# Altium project Class_first.PrjPcb
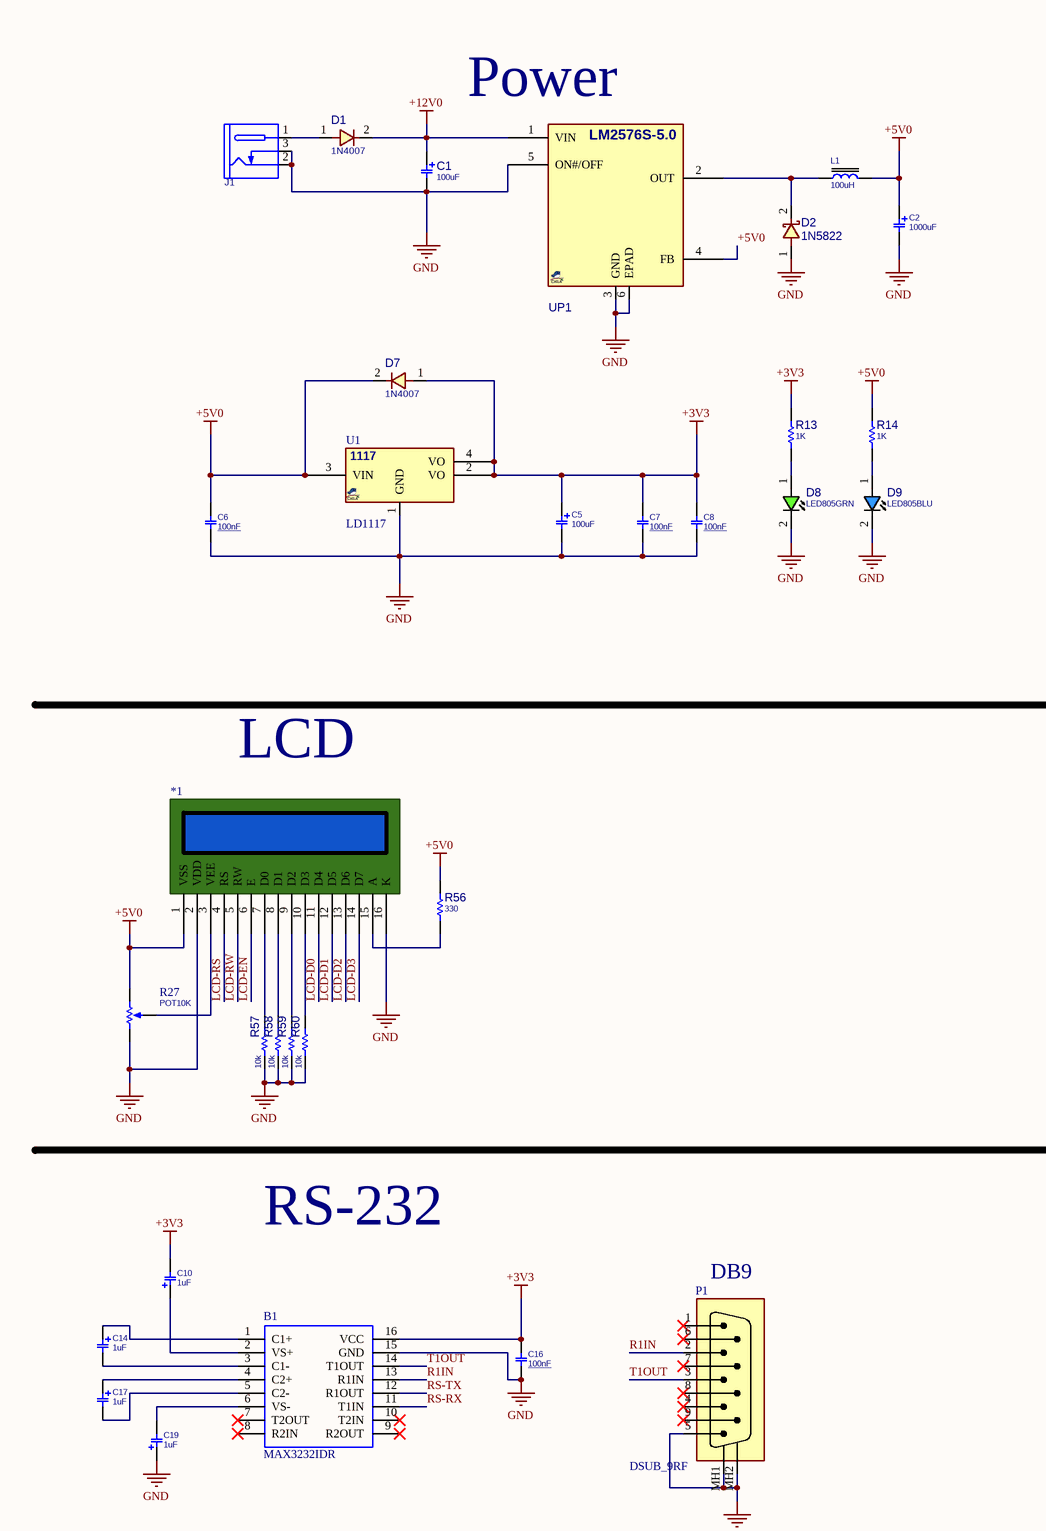
[diagram p0: Sheet1.SchDoc, top left]
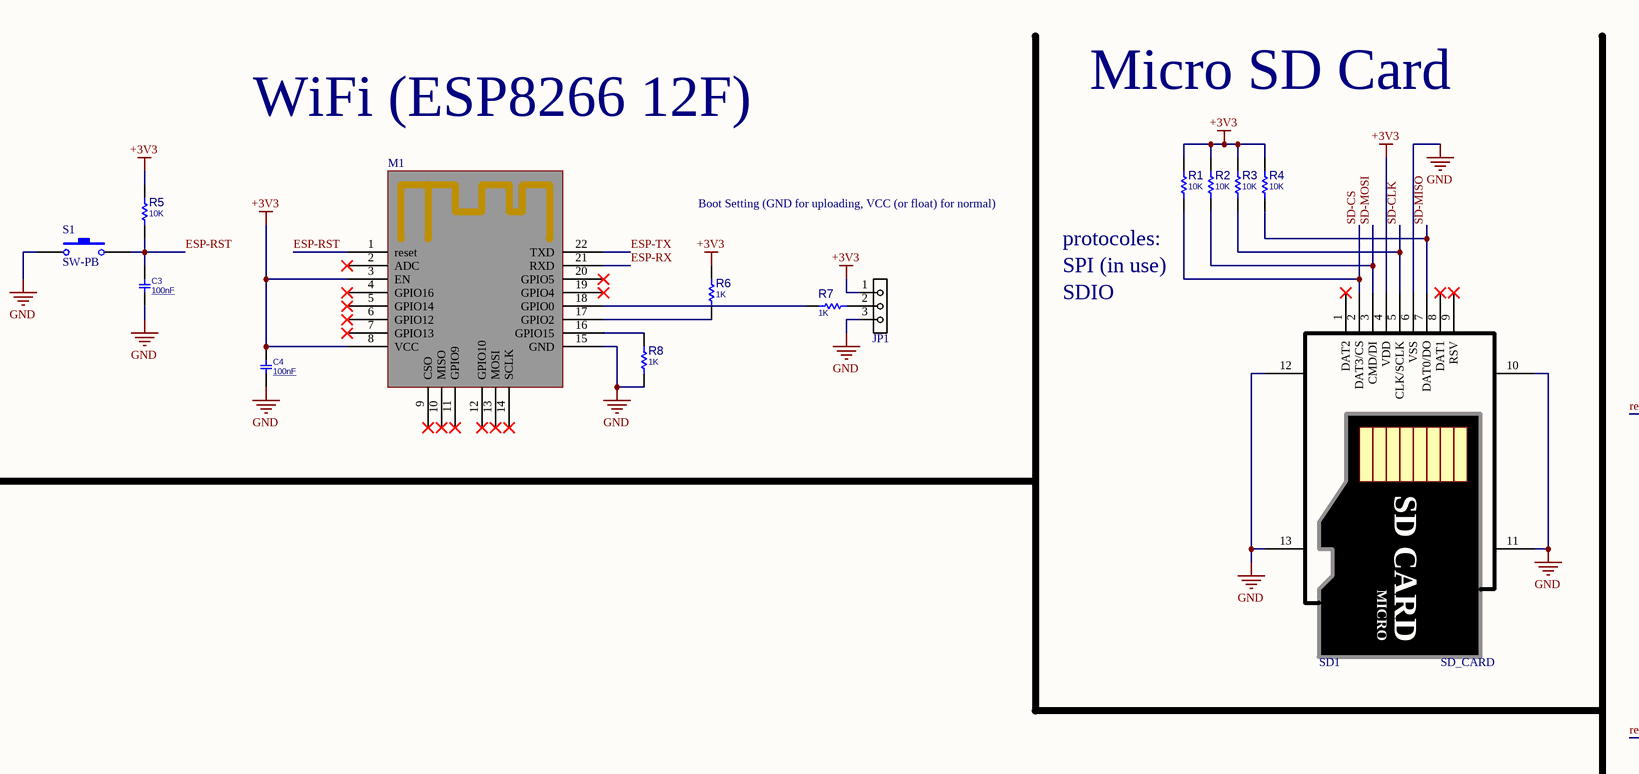
[diagram p1: Sheet1.SchDoc, top middle]
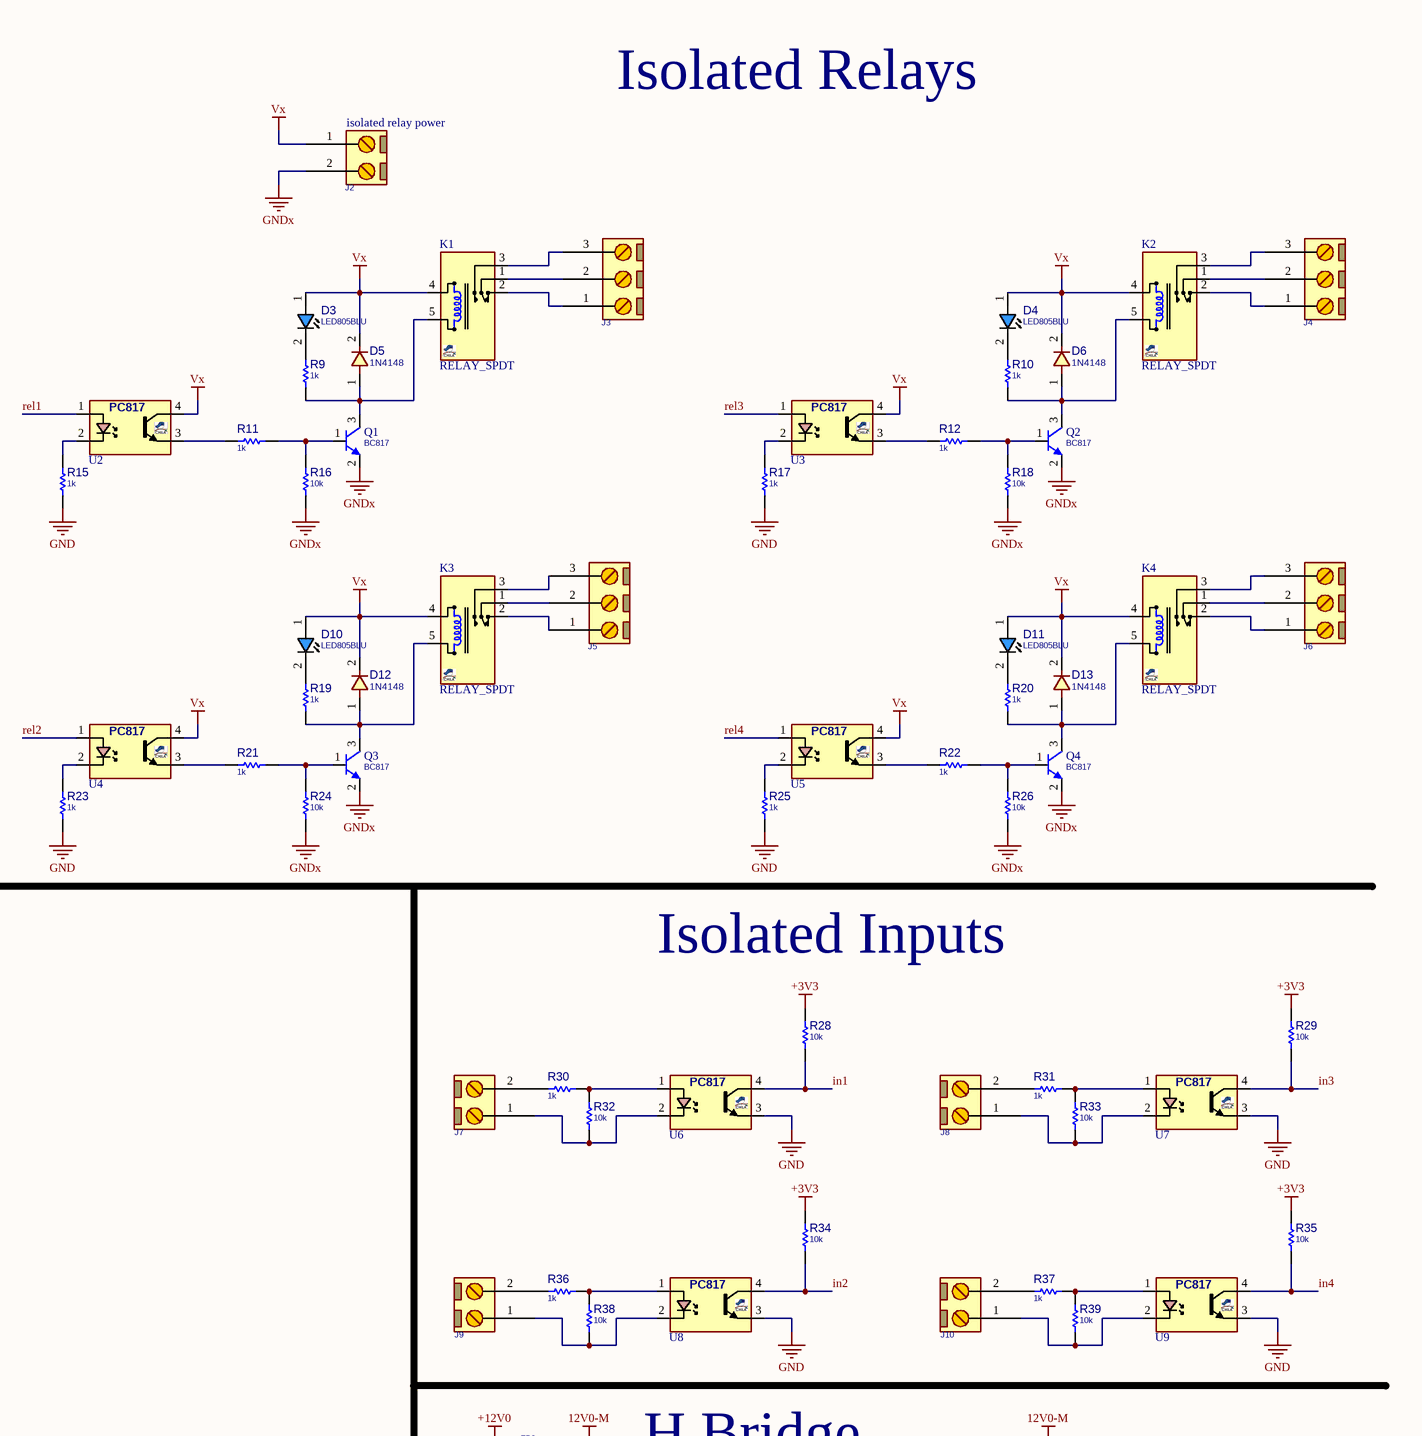
[diagram p2: Sheet1.SchDoc, top right]
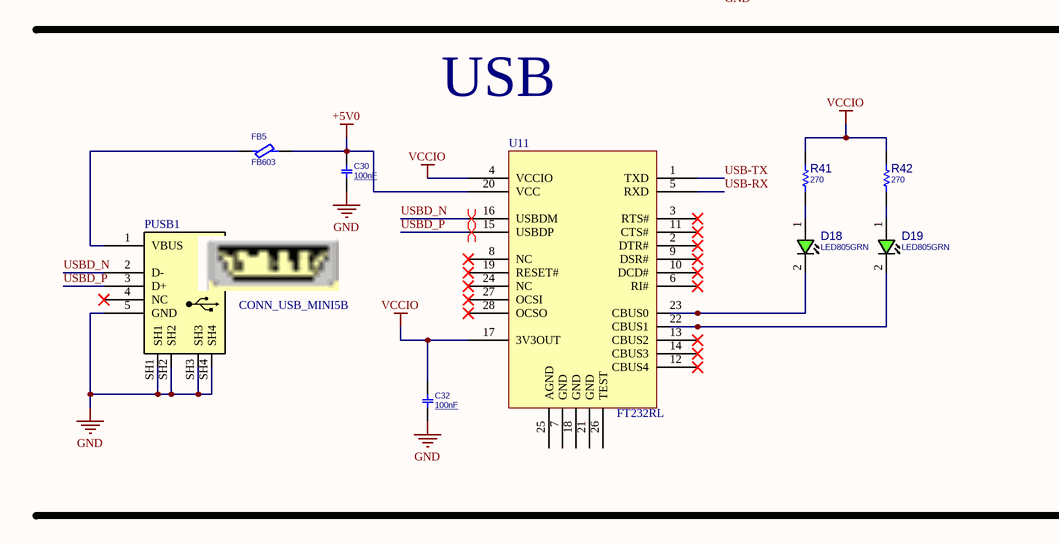
[diagram p3: Sheet1.SchDoc, bottom left]
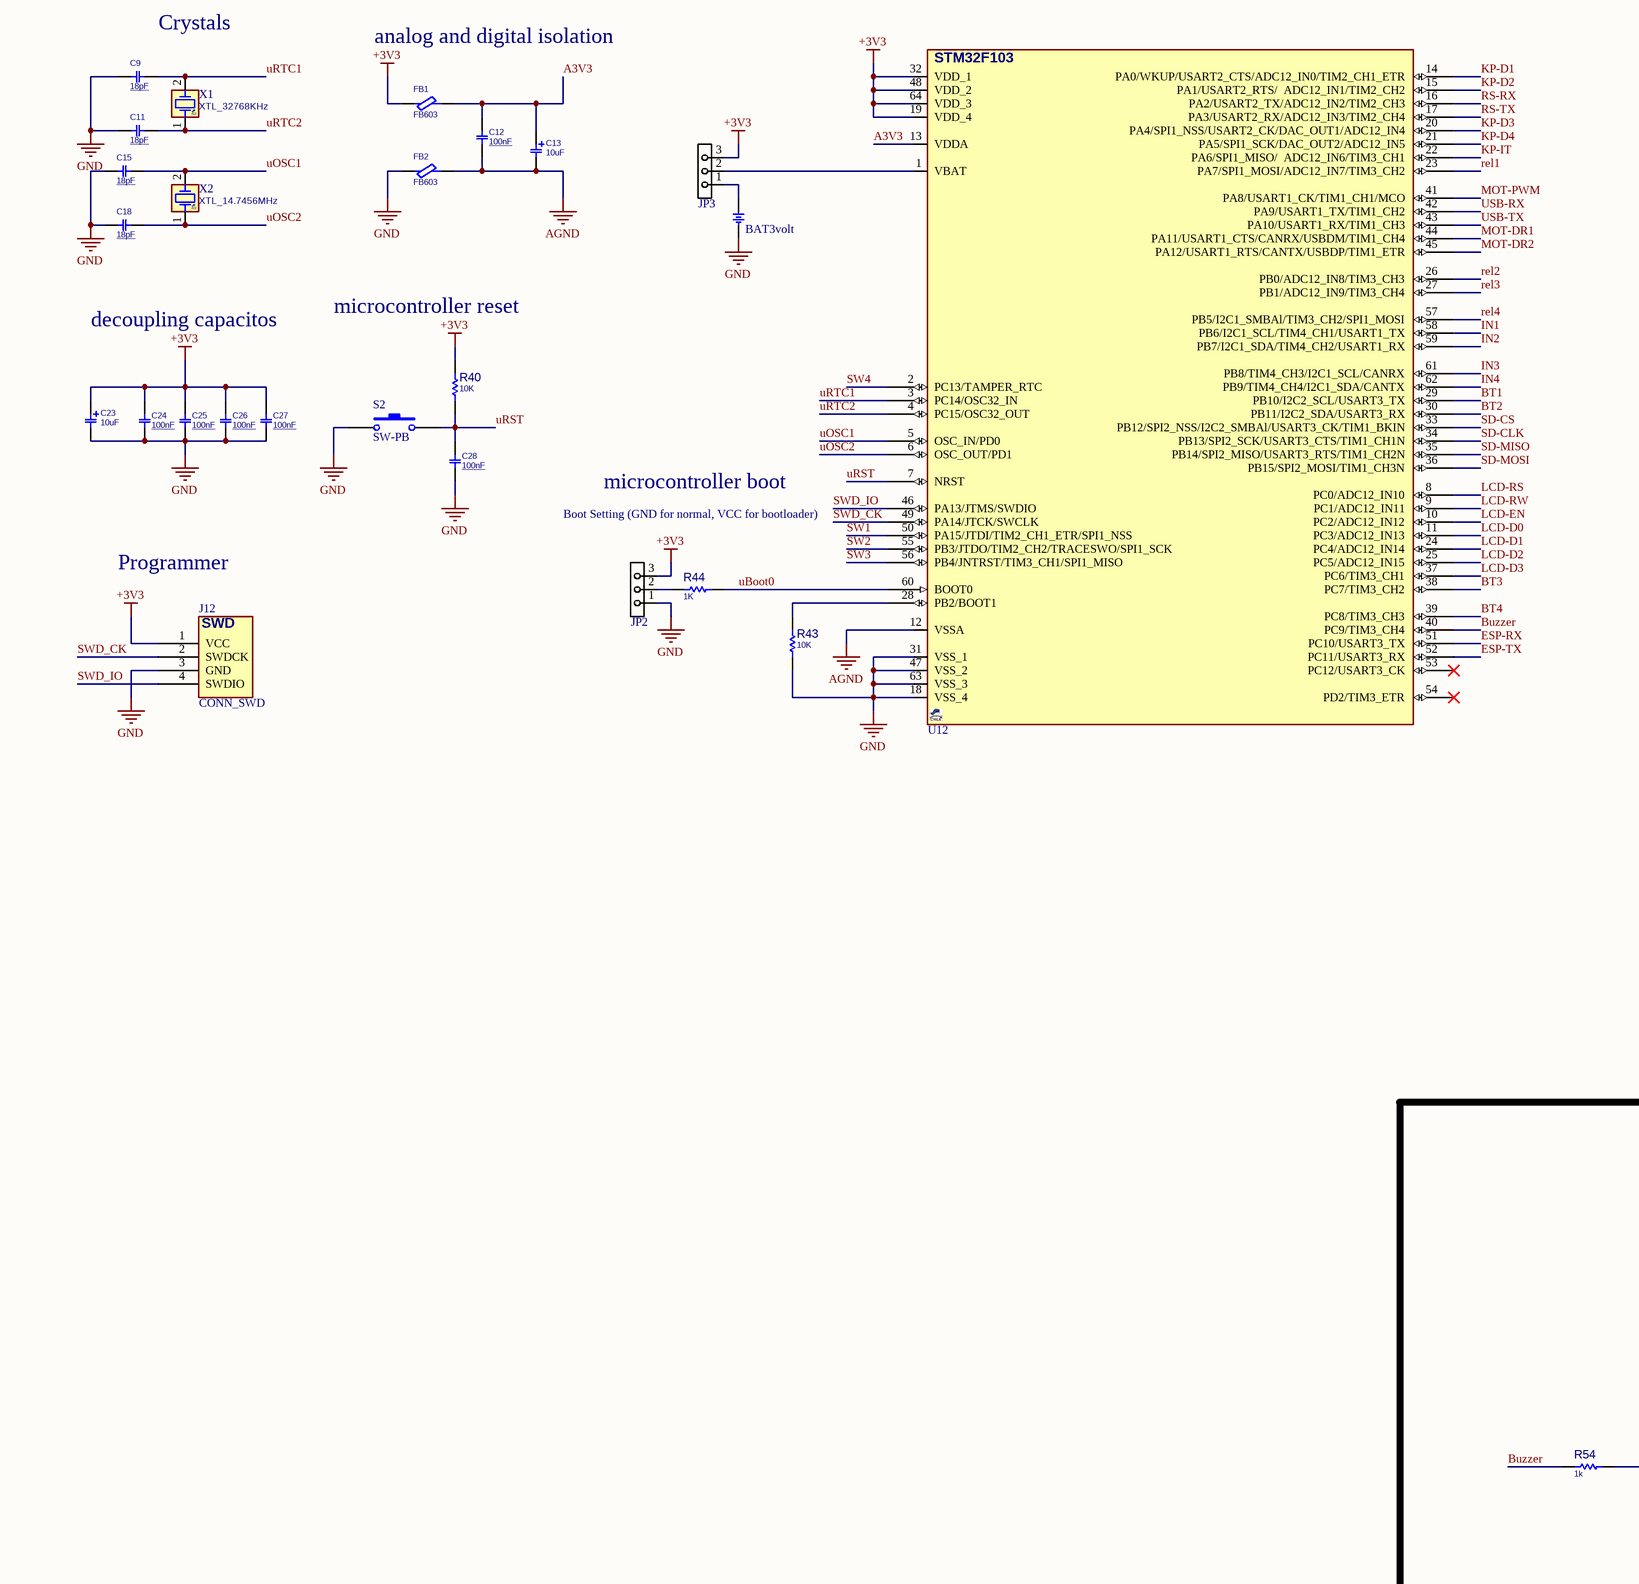
[diagram p4: Sheet1.SchDoc, bottom middle]
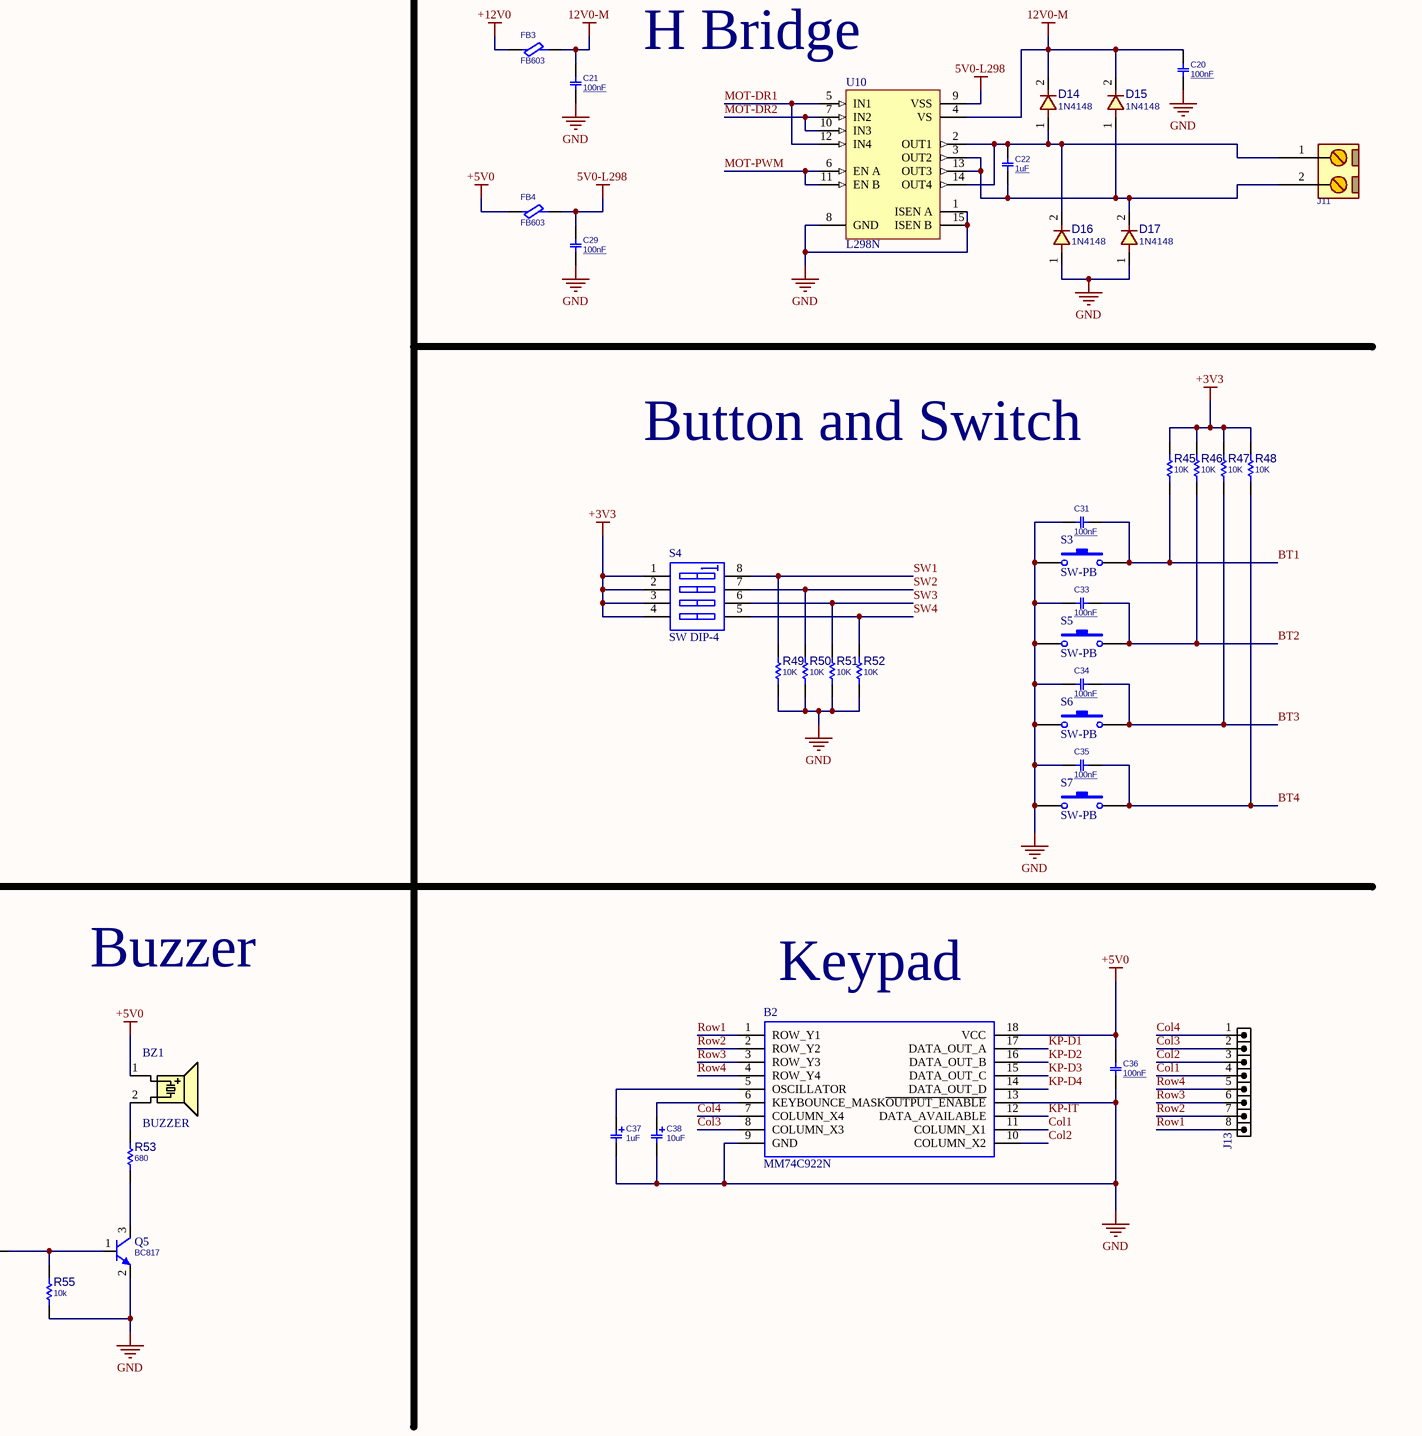
[diagram p5: Sheet1.SchDoc, bottom right]
1 sheet, 179 parts. Net scope: global (net labels, ports and power ports of the same name join across sheets).
Board file: PCB1.PcbDoc

## Sheet Sheet1.SchDoc
size A1; SheetNumber: 1; SheetTotal: 1

### Parts
*1  LCD2x16  [LCDCHAR_16X2_BLU]  (value not drawn)
B1  MAX3232IDR  [SO_16]
B2  MM74C922N  [DIP_18]
BT1  BAT3volt  [BTH1220]
BZ1  BUZZER  [BZ_C9]
C1  100uF  [C_EL_5]
C2  1000uF  [C_TN_3528]
C3  100nF  [C0805]
C4  100nF  [C0805]
C5  100uF  [C_TN_3528]
C6  100nF  [C0805]
C7  100nF  [C0805]
C8  100nF  [C0805]
C9  18pF  [C0805]
C10  1uF  [C_TN_3528]
C11  18pF  [C0805]
C12  100nF  [C0805]
C13  10uF  [C_TN_3528]
C14  1uF  [C_TN_3528]
C15  18pF  [C0805]
C16  100nF  [C0805]
C17  1uF  [C_TN_3528]
C18  18pF  [C0805]
C19  1uF  [C_TN_3528]
C20  100nF  [C0805]
C21  100nF  [C0805]
C22  1uF  [C0805]
C23  10uF  [C_TN_3528]
C24  100nF  [C0805]
C25  100nF  [C0805]
C26  100nF  [C0805]
C27  100nF  [C0805]
C28  100nF  [C0805]
C29  100nF  [C0805]
C30  100nF  [C0805]
C31  100nF  [C0805]
C32  100nF  [C0805]
C33  100nF  [C0805]
C34  100nF  [C0805]
C35  100nF  [C0805]
C36  100nF  [C0805]
C37  1uF  [C_TN_3528]
C38  10uF  [C_TN_3528]
D1  1N4007  [D_SMA]
D2  1N5822  [D_SMA]
D3  LED805BLU  [LED0805BLU]
D4  LED805BLU  [LED0805BLU]
D5  1N4148  [D_SOD80]
D6  1N4148  [D_SOD80]
D7  1N4007  [D_SMA]
D8  LED805GRN  [LED0805GRN]
D9  LED805BLU  [LED0805BLU]
D10  LED805BLU  [LED0805BLU]
D11  LED805BLU  [LED0805BLU]
D12  1N4148  [D_SOD80]
D13  1N4148  [D_SOD80]
D14  1N4148  [D_SOD80]
D15  1N4148  [D_SOD80]
D16  1N4148  [D_SOD80]
D17  1N4148  [D_SOD80]
D18  LED805GRN  [LED0805GRN]
D19  LED805GRN  [LED0805GRN]
FB1  FB603  [L0805]
FB2  FB603  [L0805]
FB3  FB603  [L0805]
FB4  FB603  [L0805]
FB5  FB603  [L0805]
J1  DC_POWER_JACK  [JAC_PWR2]  (value not drawn)
J2  CONN_TB2  [MSTB_2]  (value not drawn)
J3  CONN_TB3  [MSTB_3]  (value not drawn)
J4  CONN_TB3  [MSTB_3]  (value not drawn)
J5  CONN_TB3  [MSTB_3]  (value not drawn)
J6  CONN_TB3  [MSTB_3]  (value not drawn)
J7  CONN_TB2  [MSTB_2]  (value not drawn)
J8  CONN_TB2  [MSTB_2]  (value not drawn)
J9  CONN_TB2  [MSTB_2]  (value not drawn)
J10  CONN_TB2  [MSTB_2]  (value not drawn)
J11  CONN_TB2  [TBB_2]  (value not drawn)
J12  CONN_SWD  [WF_4]
J13  HDR1X8  [HDR_M_1X8]  (value not drawn)
JP1  JMPHDR3PIN  [JP_3]  (value not drawn)
JP2  JMPHDR3PIN  [JP_3]  (value not drawn)
JP3  JMPHDR3PIN  [JP_3]  (value not drawn)
K1  RELAY_SPDT  [REL_SPDT_5_2216]
K2  RELAY_SPDT  [REL_SPDT_5_2216]
K3  RELAY_SPDT  [REL_SPDT_5_2216]
K4  RELAY_SPDT  [REL_SPDT_5_2216]
L1  100uH  [LTOR_25X10]
M1  ESP12F  [ESP8266_ESP12E]  (value not drawn)
P1  DSUB_9RF  [DSUB_9RF]
PUSB1  CONN_USB_MINI5B  [USB_MINI_B5_CABLE]
Q1  BC817  [SOT23_3]
Q2  BC817  [SOT23_3]
Q3  BC817  [SOT23_3]
Q4  BC817  [SOT23_3]
Q5  BC817  [SOT23_3]
R1  10K  [R0805]
R2  10K  [R0805]
R3  10K  [R0805]
R4  10K  [R0805]
R5  10K  [R0805]
R6  1K  [R0805]
R7  1K  [R0805]
R8  1K  [R0805]
R9  1k  [R0805]
R10  1k  [R0805]
R11  1k  [R0805]
R12  1k  [R0805]
R13  1K  [R0805]
R14  1K  [R0805]
R15  1k  [R0805]
R16  10k  [R0805]
R17  1k  [R0805]
R18  10k  [R0805]
R19  1k  [R0805]
R20  1k  [R0805]
R21  1k  [R0805]
R22  1k  [R0805]
R23  1k  [R0805]
R24  10k  [R0805]
R25  1k  [R0805]
R26  10k  [R0805]
R27  POT10K  [POT_3296W]
R28  10k  [R0805]
R29  10k  [R0805]
R30  1k  [R0805]
R31  1k  [R0805]
R32  10k  [R0805]
R33  10k  [R0805]
R34  10k  [R0805]
R35  10k  [R0805]
R36  1k  [R0805]
R37  1k  [R0805]
R38  10k  [R0805]
R39  10k  [R0805]
R40  10K  [R0805]
R41  270  [R0805]
R42  270  [R0805]
R43  10K  [R0805]
R44  1K  [R0805]
R45  10K  [R0805]
R46  10K  [R0805]
R47  10K  [R0805]
R48  10K  [R0805]
R49  10K  [R0805]
R50  10K  [R0805]
R51  10K  [R0805]
R52  10K  [R0805]
R53  680  [R0805]
R54  1k  [R0805]
R55  10k  [R0805]
R56  330  [R0805]
R57  10k  [R0805]
R58  10k  [R0805]
R59  10k  [R0805]
R60  10k  [R0805]
S1  SW-PB  [SWPBS_SPST_6X3X5]
S2  SW-PB  [SWPBS_SPST_6X3X5]
S3  SW-PB  [SWPBS_SPST_6X3X5]
S4  SW DIP-4  [DIPSW254_4]
S5  SW-PB  [SWPBS_SPST_6X3X5]
S6  SW-PB  [SWPBS_SPST_6X3X5]
S7  SW-PB  [SWPBS_SPST_6X3X5]
SD1  SD_CARD  [SDMICRO_AT]
U1  LD1117  [SOT223_4]
U2  PC817  [DIP_4]  (value not drawn)
U3  PC817  [DIP_4]  (value not drawn)
U4  PC817  [DIP_4]  (value not drawn)
U5  PC817  [DIP_4]  (value not drawn)
U6  PC817  [DIP_4]  (value not drawn)
U7  PC817  [DIP_4]  (value not drawn)
U8  PC817  [DIP_4]  (value not drawn)
U9  PC817  [DIP_4]  (value not drawn)
U10  L298N  [MULTIWATT_15V]
U11  FT232RL  [SOG65_28_W]
U12  STM32F103RET6  [QFG50_64]  (value not drawn)
UP1  LM2576S-5.0  [D2PAK_5]  (value not drawn)
X1  XTL_32768KHz  [XTL_2_11X5]
X2  XTL_14.7456MHz  [XTL_2_11X5]

### Nets
5V0-L298: C29.1 FB4.2 U10.9(VSS)
12V0-M: C20.1 C21.1 D14.2 D15.2 FB3.2 U10.4(VS)
+3V3: B1.16(VCC) C4.2 C5.1 C7.2 C8.2 C10.2 C16.1 C23.1 C24.2 C25.2 C26.2 C27.2 D7.1 FB1.1 J12.1(VCC) JP1.1 JP2.3 JP3.3 M1.3(EN) M1.8(VCC) R1.2 R2.2 R3.2 R4.2 R5.2 R6.2 R13.2 R28.2 R29.2 R34.2 R35.2 R40.2 R45.1 R46.1 R47.1 R48.1 S4.1(A1) S4.2(A2) S4.3(A3) S4.4(A4) SD1.4(VDD) U1.2(VO) U1.4(VO) U12.19(VDD_4) U12.32(VDD_1) U12.48(VDD_2) U12.64(VDD_3)
+5V0: *1.1(VSS) B2.18(VCC) BZ1.1(A) C2.1 C6.2 C30.1 C36.1 D7.2 FB4.1 FB5.2 L1.2 R14.2 R27.3(BOT) R56.2 U1.3(VIN) U11.20(VCC) UP1.4(FB)
+12V0: C1.1 D1.2 FB3.1 UP1.1(VIN)
AGND: C12.1 C13.2 FB2.2 U12.12(VSSA)
GND: *1.2(VDD) *1.16(K) B1.15(GND) B2.9(GND) B2.13(~{OUTPUT_ENABLE}) BT1.2 C1.2 C2.2 C3.1 C4.1 C5.2 C6.1 C7.1 C8.1 C9.2 C11.2 C15.2 C16.2 C18.2 C19.1 C20.2 C21.2 C23.2 C24.1 C25.1 C26.1 C27.1 C28.1 C29.2 C30.2 C31.2 C32.2 C33.2 C34.2 C35.2 C36.2 C37.2 C38.2 D2.1 D8.2(CATHODE) D9.2(CATHODE) D16.1 D17.1 FB2.1 J1.2(SLEEVE) J1.3(INSERTION_DET) J12.3(GND) JP1.3 JP2.1 M1.15(GND) P1.5 P1.MH1 P1.MH2 PUSB1.5(GND) PUSB1.SH1 PUSB1.SH2 PUSB1.SH3 PUSB1.SH4 Q5.2(E) R8.1 R15.1 R17.1 R23.1 R25.1 R27.1(TOP) R43.1 R49.2 R50.2 R51.2 R52.2 R55.2 R57.1 R58.1 R59.1 R60.1 S1.1 S2.1 S3.1 S5.1 S6.1 S7.1 SD1.6(VSS) SD1.10(BODY) SD1.11(BODY) SD1.12(BODY) SD1.13(BODY) U1.1(GND) U6.3(E) U7.3(E) U8.3(E) U9.3(E) U10.1(ISEN_A) U10.8(GND) U10.15(ISEN_B) U12.18(VSS_4) U12.31(VSS_1) U12.47(VSS_2) U12.63(VSS_3) UP1.3(GND) UP1.5(ON#/OFF) UP1.6(EPAD)
GNDx: J2.2 Q1.2(E) Q2.2(E) Q3.2(E) Q4.2(E) R16.1 R18.1 R24.1 R26.1
VCCIO: C32.1 R41.2 R42.2 U11.4(VCCIO) U11.17(3V3OUT)
Vx: D3.1(ANODE) D4.1(ANODE) D5.2 D6.2 D10.1(ANODE) D11.1(ANODE) D12.2 D13.2 J2.1 K1.4(T1) K2.4(T1) K3.4(T1) K4.4(T1) U2.4(C) U3.4(C) U4.4(C) U5.4(C)
A3V3: C12.2 C13.1 FB1.2 U12.13(VDDA)
BT1: C31.1 R45.2 S3.2 U12.29(PB10/I2C2_SCL/USART3_TX)
BT2: C33.1 R46.2 S5.2 U12.30(PB11/I2C2_SDA/USART3_RX)
BT3: C34.1 R47.2 S6.2 U12.38(PC7/TIM3_CH2)
BT4: C35.1 R48.2 S7.2 U12.39(PC8/TIM3_CH3)
Buzzer: R54.1 U12.40(PC9/TIM3_CH4)
Col1: B2.11(COLUMN_X1) J13.4
Col2: B2.10(COLUMN_X2) J13.3
Col3: B2.8(COLUMN_X3) J13.2
Col4: B2.7(COLUMN_X4) J13.1
ESP-RST: C3.2 M1.1(reset) R5.1 S1.2
ESP-RX: M1.21(RXD) U12.51(PC10/USART3_TX)
ESP-TX: M1.22(TXD) U12.52(PC11/USART3_RX)
in1: R28.1 U6.4(C) U12.58(PB6/I2C1_SCL/TIM4_CH1/USART1_TX)
in2: R34.1 U8.4(C) U12.59(PB7/I2C1_SDA/TIM4_CH2/USART1_RX)
in3: R29.1 U7.4(C) U12.61(PB8/TIM4_CH3/I2C1_SCL/CANRX)
in4: R35.1 U9.4(C) U12.62(PB9/TIM4_CH4/I2C1_SDA/CANTX)
KP-D1: B2.17(DATA_OUT_A) U12.14(PA0/WKUP/USART2_CTS/ADC12_IN0/TIM2_CH1_ETR)
KP-D2: B2.16(DATA_OUT_B) U12.15(PA1/USART2_RTS/__ADC12_IN1/TIM2_CH2)
KP-D3: B2.15(DATA_OUT_C) U12.20(PA4/SPI1_NSS/USART2_CK/DAC_OUT1/ADC12_IN4)
KP-D4: B2.14(DATA_OUT_D) U12.21(PA5/SPI1_SCK/DAC_OUT2/ADC12_IN5)
KP-IT: B2.12(DATA_AVAILABLE) U12.22(PA6/SPI1_MISO/__ADC12_IN6/TIM3_CH1)
LCD-D0: *1.11(D4) U12.11(PC3/ADC12_IN13)
LCD-D1: *1.12(D5) U12.24(PC4/ADC12_IN14)
LCD-D2: *1.13(D6) U12.25(PC5/ADC12_IN15)
LCD-D3: *1.14(D7) U12.37(PC6/TIM3_CH1)
LCD-EN: *1.6(E) U12.10(PC2/ADC12_IN12)
LCD-RS: *1.4(RS) U12.8(PC0/ADC12_IN10)
LCD-RW: *1.5(RW) U12.9(PC1/ADC12_IN11)
MOT-DR1: U10.5(IN1) U10.12(IN4) U12.44(PA11/USART1_CTS/CANRX/USBDM/TIM1_CH4)
MOT-DR2: U10.7(IN2) U10.10(IN3) U12.45(PA12/USART1_RTS/CANTX/USBDP/TIM1_ETR)
MOT-PWM: U10.6(EN_A) U10.11(EN_B) U12.41(PA8/USART1_CK/TIM1_CH1/MCO)
R1IN: B1.13(R1IN) P1.2
rel1: U2.1(A) U12.23(PA7/SPI1_MOSI/ADC12_IN7/TIM3_CH2)
rel2: U4.1(A) U12.26(PB0/ADC12_IN8/TIM3_CH3)
rel3: U3.1(A) U12.27(PB1/ADC12_IN9/TIM3_CH4)
rel4: U5.1(A) U12.57(PB5/I2C1_SMBAl/TIM3_CH2/SPI1_MOSI)
Row1: B2.1(ROW_Y1) J13.8
Row2: B2.2(ROW_Y2) J13.7
Row3: B2.3(ROW_Y3) J13.6
Row4: B2.4(ROW_Y4) J13.5
RS-RX: B1.11(T1IN) U12.16(PA2/USART2_TX/ADC12_IN2/TIM2_CH3)
RS-TX: B1.12(R1OUT) U12.17(PA3/USART2_RX/ADC12_IN3/TIM2_CH4)
SD-CLK: R3.1 SD1.5(CLK/SCLK) U12.34(PB13/SPI2_SCK/USART3_CTS/TIM1_CH1N)
SD-CS: R1.1 SD1.2(DAT3/CS) U12.33(PB12/SPI2_NSS/I2C2_SMBAl/USART3_CK/TIM1_BKIN)
SD-MISO: R4.1 SD1.7(DAT0/DO) U12.35(PB14/SPI2_MISO/USART3_RTS/TIM1_CH2N)
SD-MOSI: R2.1 SD1.3(CMD/DI) U12.36(PB15/SPI2_MOSI/TIM1_CH3N)
SW1: R49.1 S4.8(B1) U12.50(PA15/JTDI/TIM2_CH1_ETR/SPI1_NSS)
SW2: R50.1 S4.7(B2) U12.55(PB3/JTDO/TIM2_CH2/TRACESWO/SPI1_SCK)
SW3: R51.1 S4.6(B3) U12.56(PB4/JNTRST/TIM3_CH1/SPI1_MISO)
SW4: R52.1 S4.5(B4) U12.2(PC13/TAMPER_RTC)
SWD_CK: J12.2(SWDCK) U12.49(PA14/JTCK/SWCLK)
SWD_IO: J12.4(SWDIO) U12.46(PA13/JTMS/SWDIO)
T1OUT: B1.14(T1OUT) P1.3
uBoot0: R44.1 U12.60(BOOT0)
uOSC1: C15.1 U12.5(OSC_IN/PD0) X2.2(OSC2)
uOSC2: C18.1 U12.6(OSC_OUT/PD1) X2.1(OSC1)
uRST: C28.2 R40.1 S2.2 U12.7(NRST)
uRTC1: C9.1 U12.3(PC14/OSC32_IN) X1.2(OSC2)
uRTC2: C11.1 U12.4(PC15/OSC32_OUT) X1.1(OSC1)
USB-RX: U11.5(RXD) U12.42(PA9/USART1_TX/TIM1_CH2)
USB-TX: U11.1(TXD) U12.43(PA10/USART1_RX/TIM1_CH3)
USBD_N: PUSB1.2(D-) U11.16(USBDM)
USBD_P: PUSB1.3(D+) U11.15(USBDP)
Net*1_3: *1.3(VEE) R27.2(TAP)
Net*1_7: *1.7(D0) R57.2
Net*1_8: *1.8(D1) R58.2
Net*1_9: *1.9(D2) R59.2
Net*1_10: *1.10(D3) R60.2
Net*1_15: *1.15(A) R56.1
NetB1_1: B1.1(C1+) C14.1
NetB1_2: B1.2(VS+) C10.1
NetB1_3: B1.3(C1-) C14.2
NetB1_4: B1.4(C2+) C17.1
NetB1_5: B1.5(C2-) C17.2
NetB1_6: B1.6(VS-) C19.2
NetB2_5: B2.5(OSCILLATOR) C37.1
NetB2_6: B2.6(KEYBOUNCE_MASK) C38.1
NetBT1_1: BT1.1 JP3.1
NetBZ1_2: BZ1.2(B) R53.1
NetC22_1: C22.1 D14.1 D16.2 J11.1 U10.2(OUT1) U10.14(OUT4)
NetC22_2: C22.2 D15.1 D17.2 J11.2 U10.3(OUT2) U10.13(OUT3)
NetD1_1: D1.1 J1.1(TIP)
NetD2_2: D2.2 L1.1 UP1.2(OUT)
NetD3_2: D3.2(CATHODE) R9.2
NetD4_2: D4.2(CATHODE) R10.2
NetD5_1: D5.1 K1.5(T2) Q1.3(C) R9.1
NetD6_1: D6.1 K2.5(T2) Q2.3(C) R10.1
NetD8_1: D8.1(ANODE) R13.1
NetD9_1: D9.1(ANODE) R14.1
NetD10_2: D10.2(CATHODE) R19.2
NetD11_2: D11.2(CATHODE) R20.2
NetD12_1: D12.1 K3.5(T2) Q3.3(C) R19.1
NetD13_1: D13.1 K4.5(T2) Q4.3(C) R20.1
NetD18_1: D18.1(ANODE) R41.1
NetD18_2: D18.2(CATHODE) U11.23(CBUS0)
NetD19_1: D19.1(ANODE) R42.1
NetD19_2: D19.2(CATHODE) U11.22(CBUS1)
NetFB5_1: FB5.1 PUSB1.1(VBUS)
NetJ3_1: J3.1 K1.2(NC)
NetJ3_2: J3.2 K1.1(COM)
NetJ3_3: J3.3 K1.3(NO)
NetJ4_1: J4.1 K2.2(NC)
NetJ4_2: J4.2 K2.1(COM)
NetJ4_3: J4.3 K2.3(NO)
NetJ5_1: J5.1 K3.2(NC)
NetJ5_2: J5.2 K3.1(COM)
NetJ5_3: J5.3 K3.3(NO)
NetJ6_1: J6.1 K4.2(NC)
NetJ6_2: J6.2 K4.1(COM)
NetJ6_3: J6.3 K4.3(NO)
NetJ7_1: J7.1 R32.1 U6.2(K)
NetJ7_2: J7.2 R30.2
NetJ8_1: J8.1 R33.1 U7.2(K)
NetJ8_2: J8.2 R31.2
NetJ9_1: J9.1 R38.1 U8.2(K)
NetJ9_2: J9.2 R36.2
NetJ10_1: J10.1 R39.1 U9.2(K)
NetJ10_2: J10.2 R37.2
NetJP1_2: JP1.2 R7.1
NetJP2_2: JP2.2 R44.2
NetJP3_2: JP3.2 U12.1(VBAT)
NetM1_16: M1.16(GPIO15) R8.2
NetM1_17: M1.17(GPIO2) R6.1
NetM1_18: M1.18(GPIO0) R7.2
NetQ1_1: Q1.1(B) R11.1 R16.2
NetQ2_1: Q2.1(B) R12.1 R18.2
NetQ3_1: Q3.1(B) R21.1 R24.2
NetQ4_1: Q4.1(B) R22.1 R26.2
NetQ5_1: Q5.1(B) R54.2 R55.1
NetQ5_3: Q5.3(C) R53.2
NetR11_2: R11.2 U2.3(E)
NetR12_2: R12.2 U3.3(E)
NetR15_2: R15.2 U2.2(K)
NetR17_2: R17.2 U3.2(K)
NetR21_2: R21.2 U4.3(E)
NetR22_2: R22.2 U5.3(E)
NetR23_2: R23.2 U4.2(K)
NetR25_2: R25.2 U5.2(K)
NetR30_1: R30.1 R32.2 U6.1(A)
NetR31_1: R31.1 R33.2 U7.1(A)
NetR36_1: R36.1 R38.2 U8.1(A)
NetR37_1: R37.1 R39.2 U9.1(A)
NetR43_2: R43.2 U12.28(PB2/BOOT1)

Not connected (* = marked no-connect by the designer): B1 7(T2OUT)* 8(R2IN)* 9(R2OUT)* 10(T2IN)*; M1 2(ADC)* 4(GPIO16)* 5(GPIO14)* 6(GPIO12)* 7(GPIO13)* 9(CSO)* 10(MISO)* 11(GPIO9)* 12(GPIO10)* 13(MOSI)* 14(SCLK)* 19(GPIO4)* 20(GPIO5)*; P1 1* 4* 6* 7* 8* 9*; PUSB1 4(NC)*; SD1 1(DAT2)* 8(DAT1)* 9(RSV)*; U11 2(DTR#)* 3(RTS#)* 6(RI#)* 7(GND) 8(NC)* 9(DSR#)* 10(DCD#)* 11(CTS#)* 12(CBUS4)* 13(CBUS2)* 14(CBUS3)* 18(GND) 19(RESET#)* 21(GND) 24(NC)* 25(AGND) 26(TEST) 27(OCSI)* 28(OCSO)*; U12 53(PC12/USART3_CK)* 54(PD2/TIM3_ETR)*

### Layout directives
differential pair: USBD_N, USBD_P

### Notes on the sheet
- (near UP1) Power
- WiFi (ESP8266 12F)
- Micro SD Card
- (near J2) isolated relay power
- Isolated Relays
- Boot Setting (GND for uploading, VCC (or float) for normal)
- protocoles:
- SPI (in use)
- SDIO
- LCD
- Isolated Inputs
- RS-232
- Crystals
- analog and digital isolation
- (near P1) DB9
- (near U10) H Bridge
- decoupling capacitos
- microcontroller reset
- USB
- microcontroller boot
- Boot Setting (GND for normal, VCC for bootloader)
- Programmer
- (near R45) Button and Switch
- Buzzer
- (near B2) Keypad
- (in symbol CONN_SWD) SWD
- (in symbol MICRO_SD_CARD_HOLDER) SD CARD; MICRO
- (in symbol STM32F103RET6_QFP64) STM32F103
- (in symbol VREG_1117_SOT223) 1117

### Library data of the parts
B1 = MAX232: MAX232IDR, Dual Line Transceiver, EIA/TIA-232-F, RS-232, V.28 2-TX 2-RX 2-TRX, 5 V, 16-Pin SOIC; Manufacturer_Name: Texas Instruments; Geometry.Height: 1.75mm; Manufacturer_Part_Number: MAX232IDR; Mouser Part Number: 595-MAX232IDR; Mouser Price/Stock: https://www.mouser.com/Search/Refine.aspx?Keyword=595-MAX232IDR; RS Part Number: 6606730P; RS Price/Stock: http://uk.rs-online.com/web/p/products/6606730P; Datasheet Link: http://docs-emea.rs-online.com/webdocs/13f6/0900766b813f61d7.pdf
B2 = 74c922: Encoders, Decoders, Multiplexers & Demultiplexers 16-Key Encoder; Manufacturer_Name: ON Semiconductor; Geometry.Height: 5.33mm; Manufacturer_Part_Number: MM74C922N; Mouser Part Number: 512-MM74C922N; Mouser Price/Stock: https://www.mouser.com/Search/Refine.aspx?Keyword=512-MM74C922N; RS Part Number: *; RS Price/Stock: *; Datasheet Link: https://www.fairchildsemi.com/datasheets/MM/MM74C922.pdf
BT1 = BATH_CR1220: BATTERY HOLDER, CR1220; MANF_P#: -; .: http://www.chila.ir; VALUE: BAT3volt
BZ1 = BUZZER_C9: Buzzer, 9mm, Magnetic Transducer; MANF: Mallory; MANF_P#: PB-09N23P-03Q; PARAM2: 3V, 30mA; PARAM: 2.7KHz; PRICE: $3; VALUE: BUZZER
C1 = CAP_SMD_EL: CAP, THD, ELEC,; MANF_P#: MANF_PART#; PARAM2: -V; DESC: DESCRIPTION; DIST#: MOUSER; PARAM: 20%; PRICE: 10= -$; MANF: MANF; ASSEMBLY: ASSEMBLY; VALUE: 100uF
C2 C5 C10 C13 C14 C17 C19 C23 C37 C38 = CAP_SMD_TAN: CAP, SMD, TAN,; PARAM2: -V
  C2: VALUE: 1000uF
  C5: VALUE: 100uF
  C10 C14 C17 C19 C37: VALUE: 1uF
  C13 C23 C38: VALUE: 10uF
C3 C4 C6-C9 C11 C12 C15 C16 C18 C20-C22 C24-C36 = CAP_SMD_MLCC_0805: CAP, MLCC, -F, -V, MATERIAL, -%, 0201; PARAM: -, -%; MANF_P#: MANF_PART#; PRICE: 100= 1$; MANF: -; PARAM2: -V; ASSEMBLY: ASSEMBLY
  C3 C4 C6-C8 C12 C16 C20 C21 C24-C36: VALUE: 100nF
  C9 C11 C15 C18: VALUE: 18pF
  C22: VALUE: 1uF
D1 D7 = DIODE_SMD_1N4007: DIODE, GENERAL PURPOSE, 1000V/1A; MANF: Kingtronics; DESC: DESCRIPTION; PARAM: 1000V VRRM; PARAM2: 1A; MANF_P#: M7; ASSEMBLY: ASSEMBLY; PRICE: PRICE; VALUE: 1N4007
D2 = DIODE_SMD_SCHOTTKY_1N5822: DIODE, SCHOTTKY, 40V, 3A; MANF: DIODES; DESC: DESCRIPTION; MANF_P#: 1N5822; ASSEMBLY: ASSEMBLY; PRICE: PRICE; PARAM2: 3A; PARAM: 40V; VALUE: 1N5822
D3 D4 D9-D11 = LED_SMD_0805_BLU: LED, SMD, 0805, BLUE; DESC: DESCRIPTION; MANF_P#: MANF_PART#; PARAM2: 2.2V; MANF: MANF; ASSEMBLY: ASSEMBLY; PRICE: 36t@Javan; VALUE: LED805BLU
D5 D6 D12-D17 = DIODE_SMD_1N4148_SOD80: DIODE, FAST SWTICHING, 0.3A, 0.5W; DESC: DESCRIPTION; PARAM: 75V; PARAM2: 300mA, 0.5W; MANF: MANF; ASSEMBLY: ASSEMBLY; PRICE: PRICE; MANF_P#: 1N4148; VALUE: 1N4148
D8 D18 D19 = LED_SMD_0805_GRN: LED, SMD, 0805, GREEN; PARAM: 20mA; DESC: DESCRIPTION; PARAM2: 2.2V; MANF: -; ASSEMBLY: ASSEMBLY; PRICE: 36t@Javan; MANF_P#: -; VALUE: LED805GRN
FB1-FB5 = FBEAD_SMD: FERRITE_Bead, SMD; MANF: MURATA; PARAM: 120@100MHz; PARAM2: 1A; MANF_P#: BLM15AG121SN1D; VALUE: FB603
J1 = CONN_PWR_JACKR2: CONN, PWR JACK DC, PLUG DIAM 2.0MM RA THD; MANF: CUI STACK; MANF_P#: PJ-202A, PJ-002AH, PJ-102AH, KLDX-0202; VALUE: DC_POWER_JACK
J2 J7-J10 = CONN_MSTB_2: CONN, PHOENIX MSTB, 5-G, 5.08mm pitch; VALUE: CONN_TB2
J3-J6 = CONN_MSTB_3: CONN, PHOENIX MSTB, 5-G, 5.08mm pitch; VALUE: CONN_TB3
J11 = CONN_TB2: CONN, TERMINAL BLOCK, 5.08mm pitch; VALUE: CONN_TB2
J12 = CONN_SWD: CONN, SWD, ST; VALUE: CONN_SWD
J13 = HDR_M_1X8: CONN, HEADER, Male, pitch: 2.54mm, 8POS; VALUE: HDRM8
JP1-JP3 = JUMPER_HDR_3P: JUMPER, HEADER 3PIN; MANF: MANF; MANF_P#: MANF_P#; VALUE: JMPHDR3PIN
K1-K4 = RELAY_SPDT_5_2216_HJR-3FF: Relay, SPDT, 5P, 19X15mm, 240VAC/7A; MANF: TIANBO; MANF_P#: HJR-3FF--12VDC; PARAM2: 7A, 240VAC /10A 120VAC/24VDC; PARAM: 12V, 30mA, 400Ohm; PRICE: PRICE; Value: RELAY_SPDT
L1 = IND_SMD_100uH_5A: INDUCTOR, 100uH, 5A; PARAM: 5A; PRICE: 3000t; DESC: -; MANF_P#: -; MANF: -; ASSEMBLY: ASSEMBLY; VALUE: 100uH
P1 = CONN_DSUB_9RF: CONN, DSUB, HD, 9PIN, R/A, FEMALE, THD; MANF_P#: -; MANF: -; VALUE: DSUB_9RF
PUSB1 = CONN_USB_MINI5B_CABLE: CONN, USB, MINI 5 B, R/A, SMD; MANF_P#: UX60-MB-5ST; MANF: Hirose; MANF_P#2: 67503-1020 MOLEX; VALUE: CONN_USB_MINI5B
Q1-Q5 = NPN_BC817_SOT23: BJT, NPN, 45v, 0.5A, SMD, SOT23; PARAM: 0.5A, Hfe100~600; PARAM2: 45v, 250mW; MANF: NXP, ON; MANF_P#: BC817; VALUE: BC817
R1-R26 R28-R60 = RES_SMD: RESISTOR, SMD; PARAM: -W; DESC: DESCRIPTION; DIST#: MOUSER; PARAM2: 1%; MANF_P#: -; MANF: -; ASSEMBLY: ASSEMBLY; PRICE: 100= 0.5$
  R1-R5 R40 R43 R45-R52: VALUE: 10K
  R6-R8 R13 R14 R44: VALUE: 1K
  R9-R12 R15 R17 R19-R23 R25 R30 R31 R36 R37 R54: VALUE: 1k
  R16 R18 R24 R26 R28 R29 R32-R35 R38 R39 R55 R57-R60: VALUE: 10k
  R41 R42: VALUE: 270
  R53: VALUE: 680
  R56: VALUE: 330
R27 = RES_THD_POT_MULTITURN: RESISTOR, THD, Potentiometer Multiturn, most Popular; VALUE: POT10K
S1-S3 S5-S7 = SW-PB: Switch; Published: 24-Mar-1999; LatestRevisionDate: 17-Jul-2002; LatestRevisionNote: Re-released for DXP Platform.; PackageReference: SPST-2; Publisher: Altium Limited; PackageDescription: Switch; 2 Leads
S4 = SW DIP-4: DIP Switch, 4 Position, SPST; Published: 24-Mar-1999; LatestRevisionDate: 29-May-2009; LatestRevisionNote: IPC-7351 Footprint Added.; PackageVersion: Dec-2002; PackageReference: SO8; Publisher: Altium Limited; PackageDescription: 8-Pin Small Outline Integrated Circuit 1.27 mm Pitch; Code_JEDEC: MS-012-AA; Code_IPC: SOIC127P600-8
SD1 = MICRO_SD_CARD_HOLDER
U1 = VREG_1117_SOT223: REG, Linear, LDO1V, 0.8A, SOT-223; MANF_P#: LD1117, LM1117, AMS1117, TLV1117, REG1117, NCP1117, LT1117, SPX1117; MANF: TI, ON, ST; PARAM2: 1.2/1.5/1.8/2.5/2.85/3.3/5V; PARAM: LDO1V, 0.8A; VALUE: LD1117
U2-U9 = OPTC_TR4P_PC817: OPTOCOUPLER, TRANSISTOR, 4PIN; PARAM: IF=20mA; PARAM2: VCE = 35V; MANF: SHARP; MANF_P#: PC817; PRICE: -; VALUE: PC817
U10 = L298N: Dual Full Bridge Driver; Published: 8-Jun-2000; LatestRevisionDate: 14-May-2007; LatestRevisionNote: Mapped to vertical PCB.; DatasheetVersion: Jul-1999; PackageReference: Multiwatt15V; Publisher: Altium Limited; PackageDescription: TO, Thru-Hole, Vertical, Heatsink Mounted; 15 Bent Staggered Leads; Pitch 1.27 mm; ComponentLink1Description: Manufacturer Link; ComponentLink1URL: http://www.st.com/; ComponentLink2Description: Datasheet; ComponentLink2URL: http://www.st.com/stonline/products/literature/ds/1773/l298.pdf
U12 = STM32F103RET6_QFP64: MCU, STM32 ARM 32-bit, Cortex M3, 512KB FLASH, 64KB SRAM; DESC: USB, CAN, I2C, SPI, UART; MANF: ST; PARAM2: 2~3.6VCC, 72MHz, 2X12Bit ADC; PARAM: 512KB FLASH, 64KB SRAM, -40~85oC; MANF_P#: STM32F103RET6; PRICE: 8$; VALUE: STM32F103RET6
UP1 = VREG_LM2576HVS-5: REG, Switching, Buck, 3A, 5V, 50KHz, HV, TO-263; MANF: TI, ON, HTC, MICROCHIP; PARAM: 3A,; PARAM2: 50KHz, 60VIN, 5V; MANF_P#: LM2576HVS-5.0; ASSEMBLY: ASSEMBLY; PRICE: PRICE; VALUE: LM2576S-5.0
X1 X2 = XTL_2_HC49_SMD: Crystal MOST POPULAR ABL HC49 PACKAGE
  X1: VALUE: XTL_32768KHz
  X2: VALUE: XTL_14.7456MHz